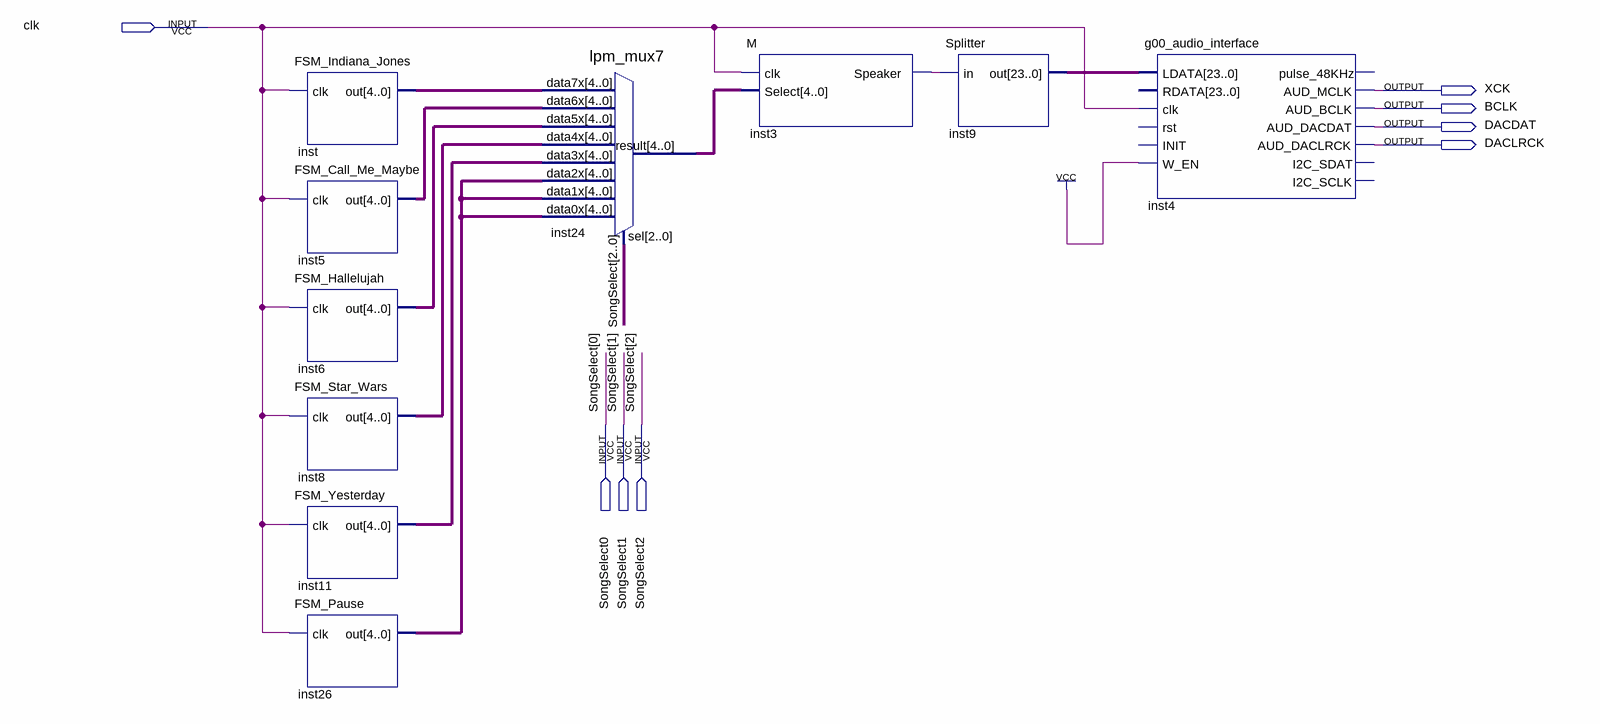
[diagram p0: schematic sheet]
// Quartus schematic Final.bdf as structural Verilog: 10 symbols, 8 pins
module Final (
  input  clk,
  input  SongSelect0,
  input  SongSelect1,
  input  SongSelect2,
  output XCK,
  output BCLK,
  output DACDAT,
  output DACLRCK
);

  wire inst3_speaker;
  wire [4:0] inst5_out, inst6_out, inst8_out, inst11_out, inst24_result, inst26_out, inst_out;
  wire [23:0] inst9_out;

  FSM_Indiana_Jones inst (.clk(clk), .out(inst_out));
  FSM_Call_Me_Maybe inst5 (.clk(clk), .out(inst5_out));
  FSM_Hallelujah inst6 (.clk(clk), .out(inst6_out));
  FSM_Star_Wars inst8 (.clk(clk), .out(inst8_out));
  FSM_Yesterday inst11 (.clk(clk), .out(inst11_out));
  FSM_Pause inst26 (.clk(clk), .out(inst26_out));
  lpm_mux7 inst24 (
    .data7x(inst_out), .data6x(inst5_out), .data5x(inst6_out), .data4x(inst8_out), .data3x(inst11_out),
    .data2x(inst26_out), .data1x(inst26_out), .data0x(inst26_out),
    .sel({SongSelect2, SongSelect1, SongSelect0}), .result(inst24_result));
  M inst3 (.clk(clk), .Select(inst24_result), .Speaker(inst3_speaker));
  Splitter inst9 (.in(inst3_speaker), .out(inst9_out));
  g00_audio_interface inst4 (
    .LDATA(inst9_out), .clk(clk), .W_EN(1'b1), .AUD_MCLK(XCK), .AUD_BCLK(BCLK), .AUD_DACDAT(DACDAT),
    .AUD_DACLRCK(DACLRCK));  // open: RDATA, rst, INIT, pulse_48KHz, I2C_SDAT, I2C_SCLK
endmodule
